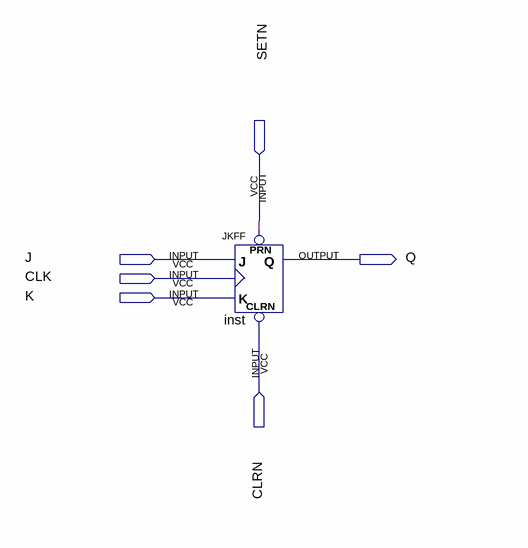
[diagram p0: schematic sheet]
// Quartus schematic lab301JKFF.bdf as structural Verilog: 1 symbols, 6 pins
module lab301JKFF (
  input  SETN,
  input  J,
  input  CLK,
  input  K,
  input  CLRN,
  output Q
);

  JKFF inst (.PRN(SETN), .CLRN(CLRN), .K(K), .J(J), .CLK(CLK), .Q(Q));
endmodule
